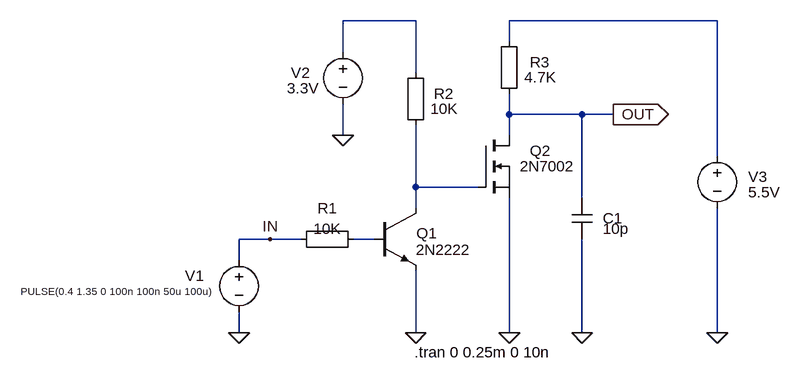
[diagram p0: schematic level_shifter_1.8-5.0.asc]
level_shifter_1.8-5.0.asc, the LTspice schematic file:
Version 4
SHEET 1 1856 840
WIRE 320 -288 208 -288
WIRE 784 -288 464 -288
WIRE 464 -256 464 -288
WIRE 208 -240 208 -288
WIRE 320 -208 320 -288
WIRE 464 -144 464 -176
WIRE 576 -144 464 -144
WIRE 624 -144 576 -144
WIRE 208 -112 208 -160
WIRE 464 -112 464 -144
WIRE 784 -80 784 -288
WIRE 320 -32 320 -128
WIRE 416 -32 320 -32
WIRE 576 -16 576 -144
WIRE 320 0 320 -32
WIRE 96 48 48 48
WIRE 144 48 96 48
WIRE 256 48 224 48
WIRE 48 80 48 48
WIRE 48 192 48 160
WIRE 320 192 320 96
WIRE 464 192 464 -16
WIRE 576 192 576 48
WIRE 784 192 784 0
FLAG 48 192 0
FLAG 320 192 0
FLAG 464 192 0
FLAG 784 192 0
FLAG 624 -144 OUT
IOPIN 624 -144 Out
FLAG 96 48 IN
FLAG 576 192 0
FLAG 208 -112 0
SYMBOL voltage 48 64 R0
WINDOW 0 -54 40 Right 2
WINDOW 3 -48 64 Right 1
WINDOW 123 0 0 Left 2
WINDOW 39 -81 91 Left 2
SYMATTR InstName V1
SYMATTR Value PULSE(0.4 1.35 0 100n 100n 50u 100u)
SYMBOL Misc\\EuropeanResistor 240 32 R90
WINDOW 0 -16 56 VBottom 2
WINDOW 3 -16 56 VTop 2
SYMATTR InstName R1
SYMATTR Value 10K
SYMATTR SpiceLine tol=1 pwr=0.1
SYMBOL npn 256 0 R0
WINDOW 0 65 39 Left 2
WINDOW 3 64 64 Left 2
SYMATTR InstName Q1
SYMATTR Value 2N2222
SYMBOL Misc\\EuropeanResistor 304 -224 R0
WINDOW 0 44 48 Left 2
WINDOW 3 39 71 Left 2
SYMATTR InstName R2
SYMATTR Value 10K
SYMATTR SpiceLine tol=1 pwr=0.1
SYMBOL nmos 416 -112 R0
WINDOW 0 80 24 Left 2
WINDOW 3 64 48 Left 2
SYMATTR InstName Q2
SYMATTR Value 2N7002
SYMBOL voltage 784 -96 R0
WINDOW 0 48 48 Left 2
WINDOW 3 48 72 Left 2
WINDOW 123 0 0 Left 2
WINDOW 39 -81 91 Left 2
SYMATTR InstName V3
SYMATTR Value 5.5V
SYMBOL Misc\\EuropeanResistor 448 -272 R0
WINDOW 0 48 48 Left 2
WINDOW 3 39 71 Left 2
SYMATTR InstName R3
SYMATTR Value 4.7K
SYMATTR SpiceLine tol=1 pwr=0.1
SYMBOL cap 560 -16 R0
WINDOW 0 48 32 Left 2
WINDOW 3 48 48 Left 2
SYMATTR InstName C1
SYMATTR Value 10p
SYMBOL voltage 208 -256 R0
WINDOW 0 -80 48 Left 2
WINDOW 3 -86 72 Left 2
WINDOW 123 0 0 Left 2
WINDOW 39 -81 91 Left 2
SYMATTR InstName V2
SYMATTR Value 3.3V
TEXT 318 222 Left 2 !.tran 0 0.25m 0 10n

The netlist it stands for:
* level_shifter_1.8-5.0.asc
V1 IN 0 PULSE(0.4 1.35 0 100n 100n 50u 100u)
R1 N004 IN 10K tol=1 pwr=0.1
Q1 N003 N004 0 0 2N2222
R2 N001 N003 10K tol=1 pwr=0.1
M§Q2 OUT N003 0 0 2N7002
V3 N002 0 5.5V
R3 N002 OUT 4.7K tol=1 pwr=0.1
C1 OUT 0 10p
V2 N001 0 3.3V
.model NPN NPN
.model PNP PNP
.lib standard.bjt
.model NMOS NMOS
.model PMOS PMOS
.lib standard.mos
.tran 0 0.25m 0 10n
.backanno
.end